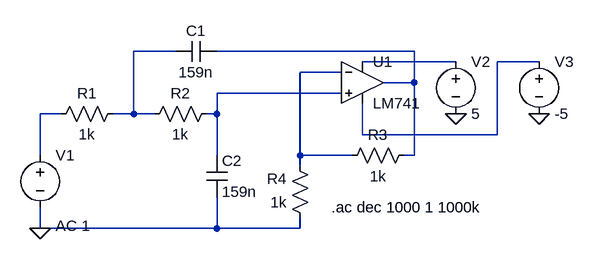
[diagram p0: schematic 2ndOrderSallenKey.asc]
2ndOrderSallenKey.asc, the LTspice schematic file:
Version 4
SHEET 1 880 680
WIRE 192 80 128 80
WIRE 560 80 256 80
WIRE 624 96 480 96
WIRE 752 96 688 96
WIRE 448 112 384 112
WIRE 560 128 560 80
WIRE 560 128 512 128
WIRE 448 144 256 144
WIRE 16 176 -16 176
WIRE 128 176 128 80
WIRE 128 176 96 176
WIRE 160 176 128 176
WIRE 256 176 256 144
WIRE 256 176 240 176
WIRE 480 208 480 160
WIRE 688 208 688 96
WIRE 688 208 480 208
WIRE -16 240 -16 176
WIRE 256 240 256 176
WIRE 384 240 384 112
WIRE 464 240 384 240
WIRE 560 240 560 128
WIRE 560 240 544 240
WIRE 384 256 384 240
WIRE -16 352 -16 320
WIRE 256 352 256 304
WIRE 256 352 -16 352
WIRE 384 352 384 336
WIRE 384 352 256 352
FLAG -16 352 0
FLAG 624 176 0
FLAG 752 176 0
SYMBOL cap 256 64 R90
WINDOW 0 0 32 VBottom 2
WINDOW 3 32 32 VTop 2
SYMATTR InstName C1
SYMATTR Value 159n
SYMBOL res 112 160 R90
WINDOW 0 0 56 VBottom 2
WINDOW 3 32 56 VTop 2
SYMATTR InstName R1
SYMATTR Value 1k
SYMBOL res 256 160 R90
WINDOW 0 0 56 VBottom 2
WINDOW 3 32 56 VTop 2
SYMATTR InstName R2
SYMATTR Value 1k
SYMBOL res 560 224 R90
WINDOW 0 0 56 VBottom 2
WINDOW 3 32 56 VTop 2
SYMATTR InstName R3
SYMATTR Value 1k
SYMBOL res 400 352 R180
WINDOW 0 36 76 Left 2
WINDOW 3 36 40 Left 2
SYMATTR InstName R4
SYMATTR Value 1k
SYMBOL cap 240 240 R0
SYMATTR InstName C2
SYMATTR Value 159n
SYMBOL voltage -16 224 R0
WINDOW 123 24 124 Left 2
WINDOW 39 0 0 Left 0
SYMATTR InstName V1
SYMATTR Value ""
SYMATTR Value2 AC 1
SYMBOL voltage 624 80 R0
WINDOW 123 0 0 Left 0
WINDOW 39 0 0 Left 0
SYMATTR InstName V2
SYMATTR Value 5
SYMBOL OpAmps\\LM741 480 64 R0
SYMATTR InstName U1
SYMBOL voltage 752 80 R0
WINDOW 123 0 0 Left 0
WINDOW 39 0 0 Left 0
SYMATTR InstName V3
SYMATTR Value -5
TEXT 432 320 Left 2 !.ac dec 1000 1 1000k

The netlist it stands for:
* 2ndOrderSallenKey.asc
C1 N002 N001 159n
R1 N001 N007 1k
R2 N006 N001 1k
R3 N002 N005 1k
R4 0 N005 1k
C2 N006 0 159n
V1 N007 0 AC 1
V2 N003 0 5
XU1 N006 N005 N003 N004 N002 LM741  ; pins In+ In- V+ V- OUT
V3 N004 0 -5
.ac dec 1000 1 1000k
.lib LM741.lib
.backanno
.end